# EAGLE design weft-microboard-0 (EAGLE 6.5.0)
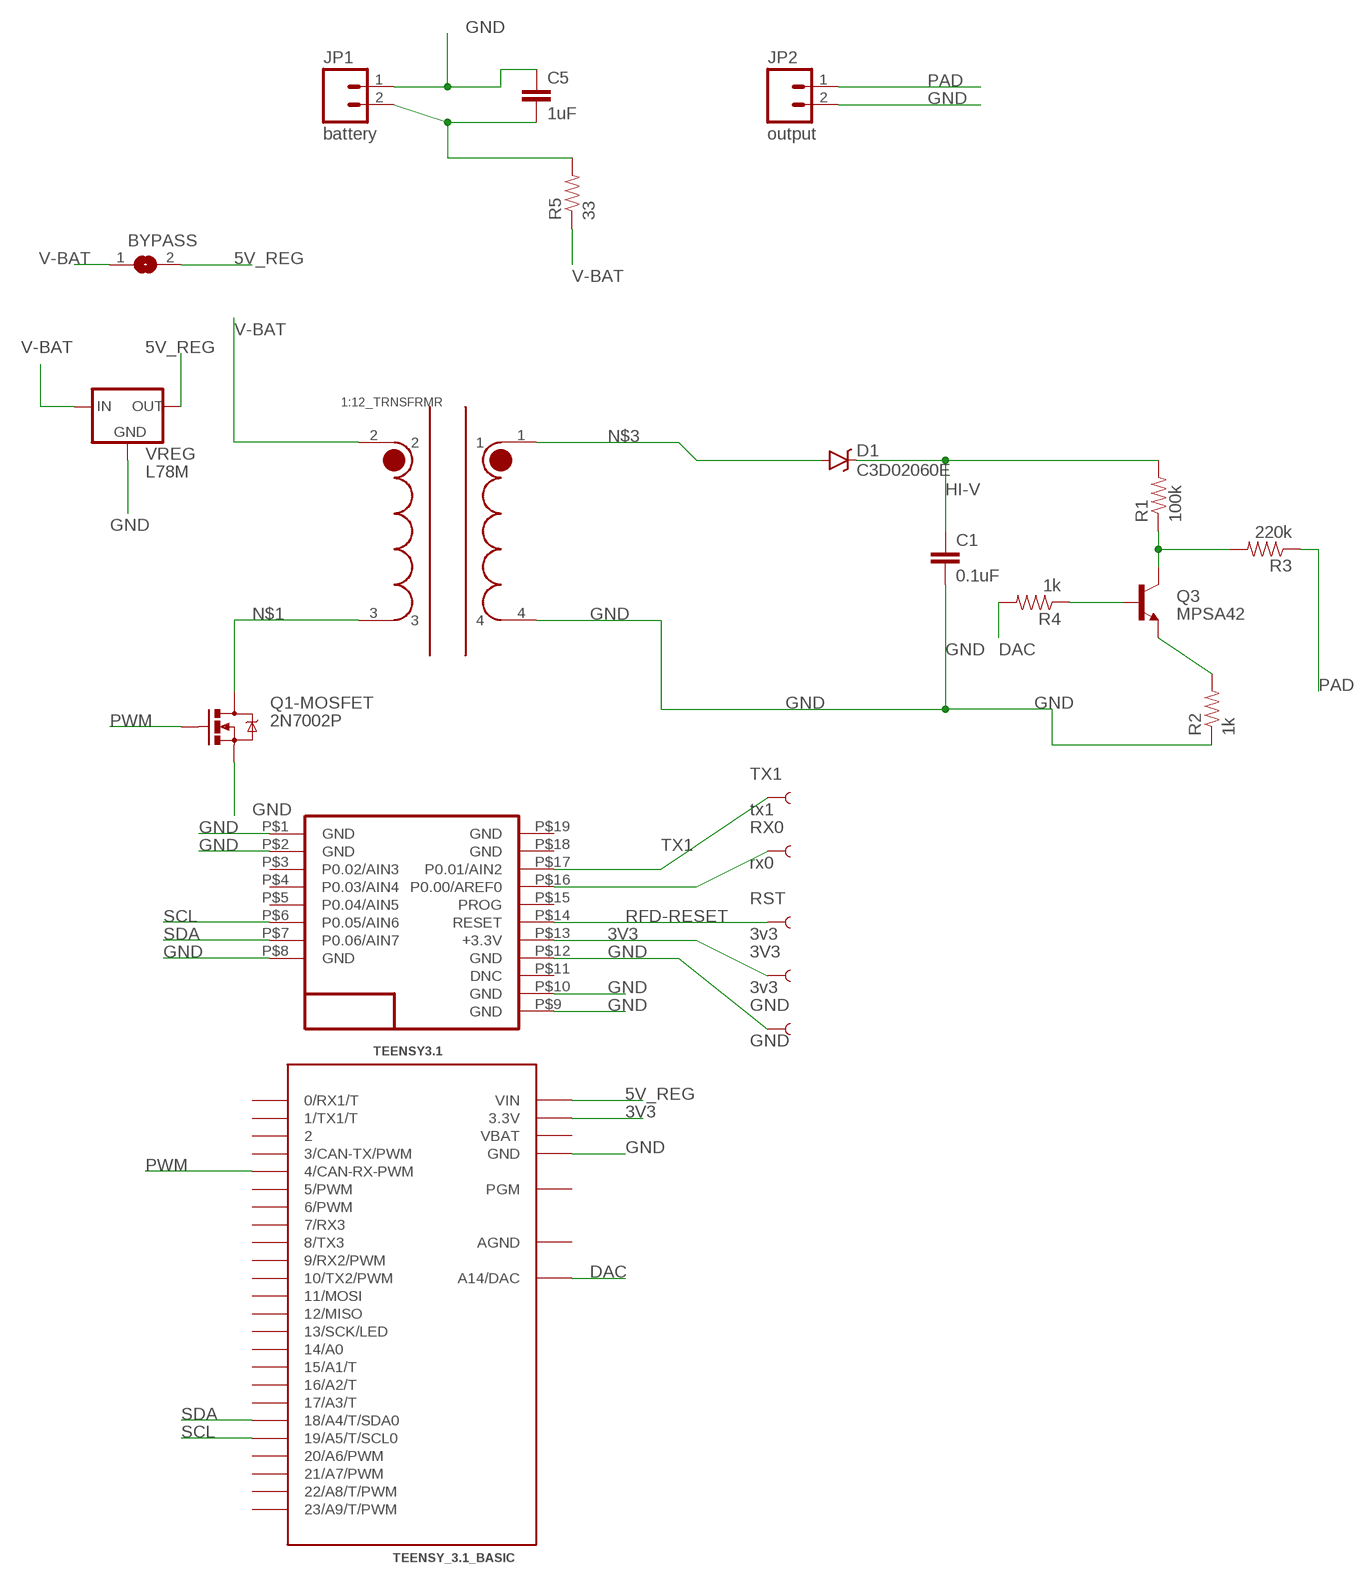
[diagram p0: schematic, sheet 1]

## Parts
1:12_TRNSFRMR  PA0367  [PA0367]
3V3  3v3  TEST-POINT3  [PAD.03X.03]
BYPASS  SJ  [SJ]
C1  0.1uF  CAP0805  [0805]
C5  1uF  CAP0805  [0805]
D1  C3D02060E  [TO252]
GND  GND  TEST-POINT3  [PAD.03X.03]
JP1  battery  M02-JST-2MM-SMT  [JST-2-SMD]
JP2  output  M02-JST-2MM-SMT  [JST-2-SMD]
Q1-MOSFET  2N7002P  MOSFET-NCHANNELBSS123LT1G  [SOT23-3]
Q3  MPSA42  TRANSISTOR_NPNMPSA42  [SOT23-3]
R1  100k  RESISTOR1206  [1206]
R2  1k  RESISTOR0805-RES  [0805]
R3  220k  RESISTOR1206  [1206]
R4  1k  RESISTOR0805-RES  [0805]
R5  33  RESISTOR0805-RES  [0805]
RFDUINO  RFD22301  [RFD21733]
RST  3v3  TEST-POINT3  [PAD.03X.03]
RX0  rx0  TEST-POINT3  [PAD.03X.03]
TEENSY3.1  TEENSY_3.1_BASIC  [TEENSY_3.1_BASIC]
TX1  tx1  TEST-POINT3  [PAD.03X.03]
VREG  L78M  [DPAK]

## Nets
3V3: 3V3.P$1 RFDUINO.P$13(+3.3V) TEENSY3.1.3.3V TEENSY3.1.3.3V1(3.3V)
5V_REG: BYPASS.2 TEENSY3.1.VIN VREG.3(OUT)
DAC: R4.2 TEENSY3.1.A14(A14/DAC)
EMIT: Q3.2(E) R2.2
GND: 1:12_TRNSFRMR.4 C1.2 C5.1 GND.P$1 JP1.1 JP2.2 Q1-MOSFET.2(S) R2.1 RFDUINO.P$1(GND) RFDUINO.P$2(GND) RFDUINO.P$8(GND) RFDUINO.P$9(GND) RFDUINO.P$10(GND) RFDUINO.P$12(GND) TEENSY3.1.GND TEENSY3.1.GND1(GND) VREG.4(GND)
HI-V: C1.1 D1.1(C) R1.2
N$1: 1:12_TRNSFRMR.3 Q1-MOSFET.3(D)
N$2: RFDUINO.P$16(P0.00/AREF0) RX0.P$1
N$3: 1:12_TRNSFRMR.1 D1.2(A)
N$4: C5.2 JP1.2 R5.2
N$13: Q3.3(C) R1.1 R3.2
N$15: Q3.1(B) R4.1
PAD: JP2.1 R3.1
PWM: Q1-MOSFET.1(G) TEENSY3.1.4(4/CAN-RX-PWM)
RFD-RESET: RFDUINO.P$14(RESET) RST.P$1
SCL: RFDUINO.P$6(P0.05/AIN6) TEENSY3.1.19/A5(19/A5/T/SCL0)
SDA: RFDUINO.P$7(P0.06/AIN7) TEENSY3.1.18/A4(18/A4/T/SDA0)
TX1: RFDUINO.P$17(P0.01/AIN2) TX1.P$1
V-BAT: 1:12_TRNSFRMR.2 BYPASS.1 R5.1 VREG.1(IN)
Unconnected: RFDUINO.P$3(P0.02/AIN3) RFDUINO.P$4(P0.03/AIN4) RFDUINO.P$5(P0.04/AIN5) RFDUINO.P$11(DNC) RFDUINO.P$15(PROG) RFDUINO.P$18(GND) RFDUINO.P$19(GND) TEENSY3.1.0(0/RX1/T) TEENSY3.1.1(1/TX1/T) TEENSY3.1.2 TEENSY3.1.3(3/CAN-TX/PWM) TEENSY3.1.5(5/PWM) TEENSY3.1.6(6/PWM) TEENSY3.1.7(7/RX3) TEENSY3.1.8(8/TX3) TEENSY3.1.9(9/RX2/PWM) TEENSY3.1.10(10/TX2/PWM) TEENSY3.1.11(11/MOSI) TEENSY3.1.12(12/MISO) TEENSY3.1.13(13/SCK/LED) TEENSY3.1.14/A0 TEENSY3.1.15/A1(15/A1/T) TEENSY3.1.16/A2(16/A2/T) TEENSY3.1.17/A3(17/A3/T) TEENSY3.1.20/A6(20/A6/PWM) TEENSY3.1.21/A7(21/A7/PWM) TEENSY3.1.22/A8(22/A8/T/PWM) TEENSY3.1.23/A9(23/A9/T/PWM) TEENSY3.1.PGM

## Power pins joined to a net without a drawn wire
AGND: TEENSY3.1.AGND
VBAT: TEENSY3.1.VBAT

## Library data of the parts
1:12_TRNSFRMR = AKA_test:PA0367: SMT Flyback Transformer For PhotoFlash Capacitor Charger For Use with Linear Technology’s LT3420 by Pulse Electronics 1:12 ratio Low side: pins 2 and 3 High side: pins 1 and 4 Pins 2 and 4 are the dotted poles in transformer schematic Min 18 uH inductance at Irated Irated: 1.5A DC Leakage Inductance (2-3 with 1-4 shorted): 0.75 uH MAX Primary DCR: 180 milliohm MAX Secondary DCR 18 ohm MAX Primary Secondary isolation: 500Vrms
3V3 GND RST RX0 TX1 = SparkFun-Passives:TEST-POINT: Bare copper test points for troubleshooting or ICT
BYPASS = jumper:SJ: SMD solder JUMPER
C1 = SparkFun-Passives:CAP: Capacitor Standard 0603 ceramic capacitor, and 0.1" leaded capacitor.
C5 = SparkFun-Capacitors:CAP: Capacitor Standard 0603 ceramic capacitor, and 0.1" leaded capacitor.
D1 = AKA_test:C3D02060E: C3D02060E Silicon Carbide Schottky Diode Z-Rec™ Rectifier 600-Volt Schottky Rectifier Optimized for PFC Boost Diode Application Zero Reverse Recovery Current Zero Forward Recovery Voltage High-Frequency Operation Temperature-Independent Switching Behavior Extremely Fast Switching Positive Temperature Coefficient on VF datasheet <http://www.cree.com/~/media/Files/Cree/Power/Data%20Sheets/C3D02060E.pdf>
JP1 JP2 = SparkFun-Connectors:M02: Standard 2-pin 0.1" header. Use with - straight break away headers ( PRT-00116) - right angle break away headers (PRT-00553) - swiss pins (PRT-00743) - machine pins (PRT-00117) - female headers (PRT-00115) Molex polarized connector foot print use with: PRT-08233 with associated crimp pins and housings. 2.54_SCREWTERM for use with PRT-10571. 3.5mm Screw Terminal footprints for PRT-08084 5mm Screw Terminal footprints for use with PRT-08432; PROD_ID: CONN-08352
Q1-MOSFET = SparkFun-DiscreteSemi:MOSFET-NCHANNEL: Common NMOSFET Parts MFG P/N Store ID Prod ID FDD8780 TRANS-09984 SI7820DN TRANS-11055 FDS6630A IC-08089 2N7002PW TRANS-11151 FQP30N06L COM-10213 TRANS-10060 BSS123LT1G TRANS-08345 BSS138 TRANS-00830 BS170 2N7000; PROD_ID: TRANS-08345
Q3 = SparkFun-DiscreteSemi:TRANSISTOR_NPN: Generic NPN BJT MMBT2222A - TRANS-08049 (SOT-23, 1A 40V) MPSA42 - TRANS-09116 (SOT-23, 500mA 300V) MMBT5088LT1G - TRANS-11160 (SOT-23, 50 mA 30V) BC547 - COM-08928 <http://www.sparkfun.com/products/8928> (TO-92 45V 100mA) (1.Collector 2.Base 3.Emitter) 2N3904 - COM-00521 <http://www.sparkfun.com/products/521> (TO-92 40V 200mA) (1.Emitter 2.Base 3.Collector) P2N2222A - COM-12852 <http://www.sparkfun.com/products/12852> (TO-92 40V 600mA) (1.Collector 2.Base 3.Emitter); PROD_ID: TRANS-09116
R1-R5 = SparkFun-Resistors:RESISTOR: Resistor Basic schematic elements and footprints for 0603, 1206, and PTH resistors.
RFDUINO = RFD22301-11.25.13:RFD22301: RF Digital RFD22301
TEENSY3.1 = Teensy_3_Series_Board_v1.0:TEENSY_3.1_BASIC: Footprint for Teensy 3.1 board using all pin connections on the outer perimeter
VREG = AKA_test:L78M

## Board
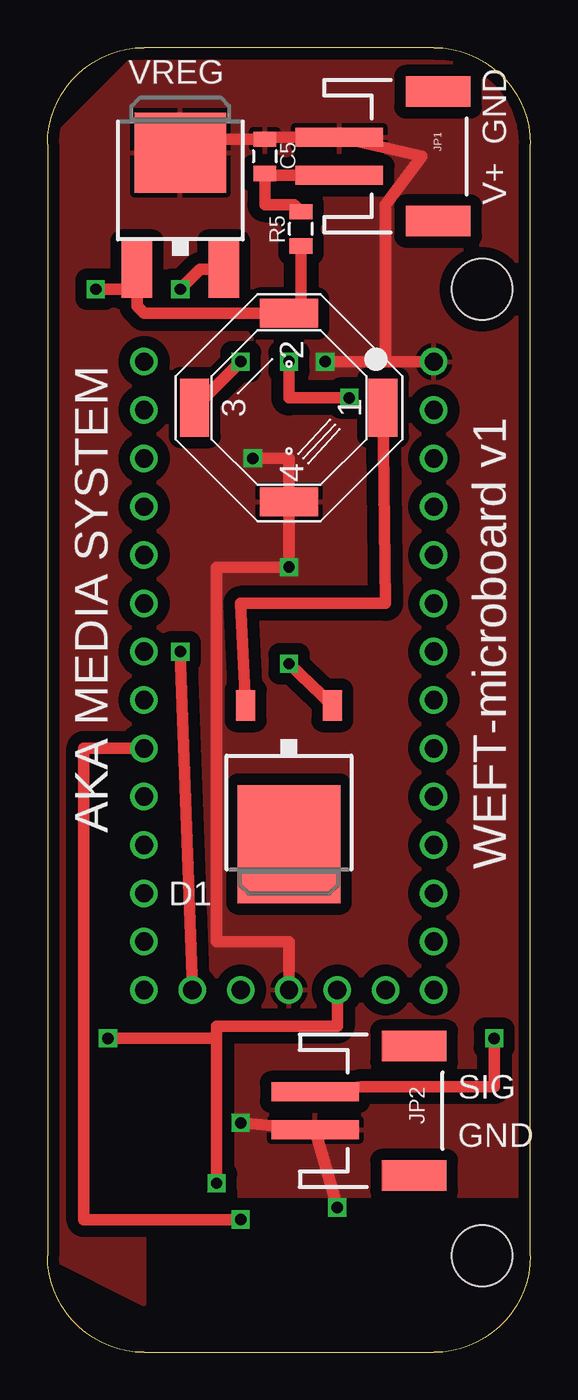
[diagram p1: board, top side]
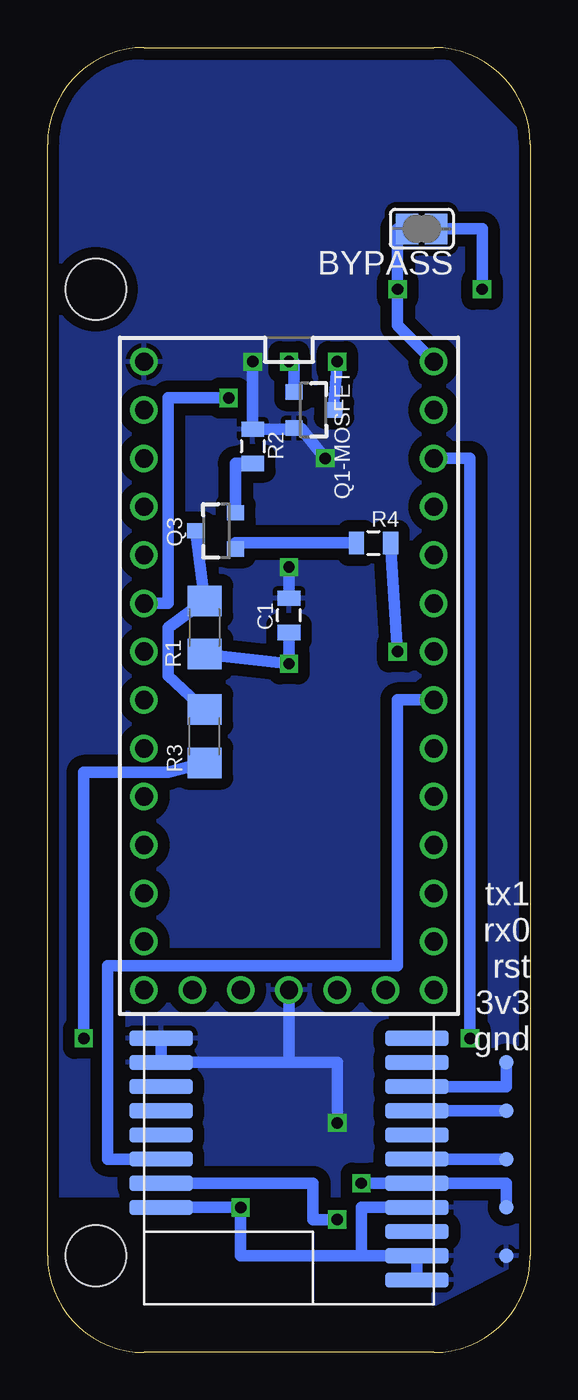
[diagram p2: board, bottom side, seen from below]

Size 25.4 x 68.58 mm. Coordinates in mm from the lower left corner, seen from the top.
Outline: 5.08,0 20.32,0 arc90 25.4,5.08 25.4,63.5 arc90 20.32,68.58 5.08,68.58 arc90 0,63.5 0,5.08 arc90 5.08,0
Copper layers (1*16): Top 0.0356mm / dielectric 1.5011mm / Bottom 0.0356mm
Design rules "LaenPCBOrder": minimum track width 6mil, minimum drill 13mil, track to track 6mil, track to pad 6mil, pad to pad 6mil, via to via 6mil, smd to smd 6mil, copper to edge 15mil, drill to drill 6mil, minimum pad ring 7mil, minimum via ring 7mil, stop-mask expansion 3mil, vias tented up to drill 0mil, thermal gap 10mil
Holes 3.2 mm at 22.86,5.08 22.86,55.88

### Footprints (pad centres in the part's own frame; a part is rotated, then mirrored left to right if it is on the bottom)
PA0367 = smd 3.048 x 1.524: 1 4.953,4.953; 3 4.953,-4.953 | smd 1.524 x 3.048: 2 0,0; 4 9.906,0
PAD.03X.03 = smd 0.762 x 0.762: P$1 0,0
SJ = smd 1.168 x 1.6: 1 -0.762,0; 2 0.762,0
0805 = smd 0.8 x 1.2: 1 -0.9,0; 2 0.9,0
TO252 = smd 1 x 1.6: 1 -2.28,-4.8; 2 2.28,-4.8 | smd 5.4 x 6.2: 3 0,2.5
JST-2-SMD = smd 1 x 4.6: 1 -1,-3.7; 2 1,-3.7 | smd 1.6 x 3.4: NC1 -3.4,1.5; NC2 3.4,1.5
SOT23-3 = smd 0.8 x 0.9: 1 -0.95,-1; 2 0.95,-1; 3 0,1.1
1206 = smd 1.6 x 1.8: 1 -1.4,0; 2 1.4,0
RFD21733 = smd 3.353 x 0.813: P$1 -6.731,6.35; P$2 -6.731,5.08; P$3 -6.731,3.81; P$4 -6.731,2.54; P$5 -6.731,1.27; P$6 -6.731,0; P$7 -6.731,-1.27; P$8 -6.731,-2.54; P$9 6.731,-6.35; P$10 6.731,-5.08; P$11 6.731,-3.81; P$12 6.731,-2.54; P$13 6.731,-1.27; P$14 6.731,0; P$15 6.731,1.27; P$16 6.731,2.54; P$17 6.731,3.81; P$18 6.731,5.08; P$19 6.731,6.35
TEENSY_3.1_BASIC = drill 0.965: 0 -7.62,13.97; 1 -7.62,11.43; 2 -7.62,8.89; 3 -7.62,6.35; 3.3V 7.62,11.43; 3.3V1 -2.54,-16.51; 4 -7.62,3.81; 5 -7.62,1.27; 6 -7.62,-1.27; 7 -7.62,-3.81; 8 -7.62,-6.35; 9 -7.62,-8.89; 10 -7.62,-11.43; 11 -7.62,-13.97; 12 -7.62,-16.51; 13 7.62,-16.51; 14/A0 7.62,-13.97; 15/A1 7.62,-11.43; 16/A2 7.62,-8.89; 17/A3 7.62,-6.35; 18/A4 7.62,-3.81; 19/A5 7.62,-1.27; 20/A6 7.62,1.27; 21/A7 7.62,3.81; 22/A8 7.62,6.35; 23/A9 7.62,8.89; A14 5.08,-16.51; AGND 7.62,13.97; GND -7.62,16.51; GND1 0,-16.51; PGM 2.54,-16.51; VBAT -5.08,-16.51; VIN 7.62,16.51
DPAK = smd 1.6 x 3: 1 -2.28,-4.04; 3 2.28,-4.04 | smd 4.826 x 4.191: 4 0,2.096

### Placement (x,y rotation side)
1:12_TRNSFRMR  12.7,54.61 270 top
3V3  1.27,7.62 0 bottom
BYPASS  5.72,59.05 180 bottom
C1  12.7,38.73 90 bottom
C5  11.43,62.87 270 top
D1  12.7,29.21 180 top
GND  1.27,5.08 0 bottom
JP1  19.05,62.87 270 top
JP2  17.78,12.7 270 top
Q1-MOSFET  11.43,49.53 270 bottom
Q3  16.51,43.18 90 bottom
R1  17.14,38.1 270 bottom
R2  14.61,47.62 270 bottom
R3  17.14,32.38 90 bottom
R4  8.25,42.55 0 bottom
R5  13.34,59.05 90 top
RFDUINO  12.7,10.16 0 bottom
RST  1.27,10.16 0 bottom
RX0  1.27,12.7 0 bottom
TEENSY3.1  12.7,35.56 0 bottom
TX1  1.27,15.24 0 bottom
VREG  6.99,60.96 0 top

### Tracks (layer width: path | path; a pad name or v marks a point on that pad's centre or on a via)
3V3  (via drill 0.6)
  Top 0.61: TEENSY3.1.3.3V1 15.24,17.14 8.89,17.14 8.89,16.51 | 8.89,16.51 v8.89,8.89 | v3.17,16.51 8.89,16.51
  Bottom 0.61: v8.89,8.89 RFDUINO.P$13 1.27,8.89 3V3.P$1 | TEENSY3.1.3.3V 3.17,46.99 v3.17,16.51
5V_REG  (via drill 0.6)
  Top 0.61: VREG.3 8.02,56.92 v6.99,55.88
  Bottom 0.61: TEENSY3.1.VIN 6.99,53.98 v6.99,55.88 6.99,59.05 BYPASS.2
DAC  (via drill 0.6)
  Top 0.61: TEENSY3.1.A14 v6.99,36.83
  Bottom 0.61: v6.99,36.83 R4.2
EMIT
  Bottom 0.61: R2.2 15.51,46.73 Q3.2
GND  (via drill 0.6)
  Top 0.61: VREG.4 7.69,63.77 C5.1 11.53,63.87 JP1.1 19.69,62.87 17.78,60.33 17.78,52.07 v14.61,52.07 TEENSY3.1.GND | v10.8,46.99 12.7,46.99 1:12_TRNSFRMR.4 v12.7,41.27 8.89,41.27 8.89,21.59 12.7,21.59 TEENSY3.1.GND1 | v15.24,7.62 JP2.2 v10.16,12.06
  Bottom 0.61: v14.61,52.07 R2.1 12.43,48.52 Q1-MOSFET.2 12.07,48.58 v10.8,46.99 | RFDUINO.P$9 RFDUINO.P$10 8.89,5.08 | RFDUINO.P$1 RFDUINO.P$2 12.7,15.24 | v12.7,41.27 C1.2 | RFDUINO.P$8 v15.24,7.62 15.24,5.08 8.89,5.08 | TEENSY3.1.GND1 12.7,15.24 | RFDUINO.P$12 8.89,7.62 8.89,5.08 | 12.7,15.24 10.16,15.24 v10.16,12.06
  pour Top (isolate 0.61): 4.45,67.94 0,63.5 0,5.08 5.08,2.54 5.08,8.26 25.4,8.26 25.4,63.5 22.86,67.94
  pour Bottom (isolate 0.61): 4.45,67.94 0,63.5 0,5.08 5.08,2.54 5.08,8.26 25.4,8.26 25.4,63.5 22.86,67.94
HI-V  (via drill 0.6)
  Top 0.61: v12.7,36.2 D1.1
  Bottom 0.61: C1.1 v12.7,36.2 R1.2
N$1  (via drill 0.6)
  Top 0.61: v10.16,52.07 1:12_TRNSFRMR.3
  Bottom 0.61: Q1-MOSFET.3 10.33,49.99 v10.16,52.07
N$2
  Bottom 0.61: RFDUINO.P$16 RX0.P$1
N$3
  Top 0.61: 1:12_TRNSFRMR.1 17.78,39.37 10.16,39.37 D1.2
N$4
  Top 0.61: R5.2 12.96,60.33 11.43,60.33 C5.2 11.53,61.87 JP1.2
N$13
  Bottom 0.61: Q3.3 R1.1 19.05,38.1 19.05,35.56 R3.2
N$15
  Bottom 0.61: R4.1 15.51,42.55 Q3.1
PAD  (via drill 0.6)
  Top 0.61: JP2.1 16.51,13.97 23.5,13.97 v23.5,16.51
  Bottom 0.61: R3.1 19.05,30.48 23.5,30.48 v23.5,16.51
PWM  (via drill 0.6)
  Top 0.61: v15.88,50.16 12.7,50.16 v12.7,52.07
  Bottom 0.61: TEENSY3.1.4 19.05,39.37 19.05,50.16 v15.88,50.16 | v12.7,52.07 12.43,52.07 Q1-MOSFET.1
RFD-RESET
  Bottom 0.61: RFDUINO.P$14 RST.P$1
SCL
  Bottom 0.61: TEENSY3.1.19/A5 6.99,34.29 6.99,20.32 22.23,20.32 22.23,10.16 RFDUINO.P$6
SDA  (via drill 0.6)
  Top 0.61: v10.16,6.99 1.91,6.99 1.91,31.75 TEENSY3.1.18/A4
  Bottom 0.61: RFDUINO.P$7 11.43,8.89 11.43,6.99 v10.16,6.99
TX1
  Bottom 0.61: RFDUINO.P$17 1.27,13.97 TX1.P$1
V-BAT  (via drill 0.6)
  Top 0.61: R5.1 13.34,55.24 1:12_TRNSFRMR.2 5.08,54.61 4.71,54.98 4.71,55.88 | VREG.1 4.71,55.88 | v2.54,55.88 4.71,55.88
  Bottom 0.61: BYPASS.1 2.54,59.05 v2.54,55.88

### Text on the board
tNames: GND | V+ | AKA MEDIA SYSTEM | WEFT-microboard v1 | SIG | GND
bNames: tx1 | rx0 | rst | 3v3 | gnd